# Altium schematic sheet End OptoSwitch.SchDoc
size A4
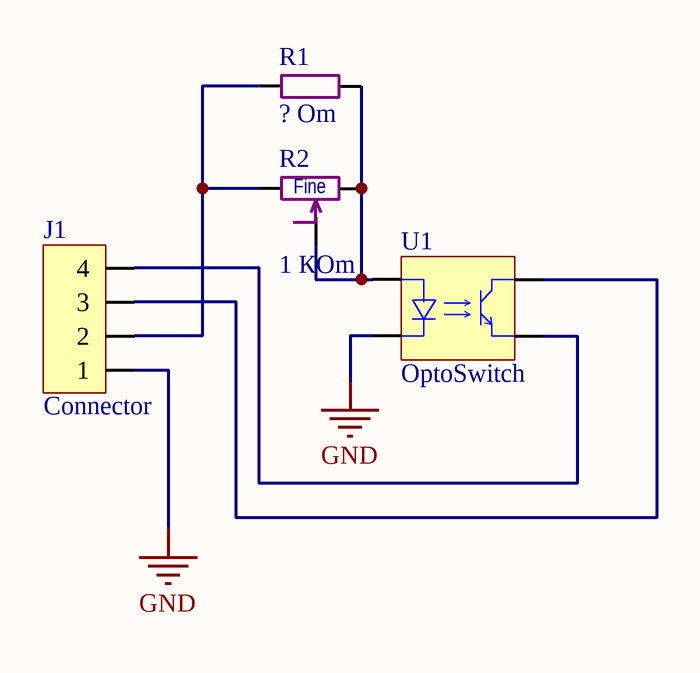
[diagram p0: End OptoSwitch.SchDoc]

## Parts
J1  Connector  [Molex Micro-Fit 3.0 - 4 pin D R]
R1  ? Om  [SMD 0805 (2012)]
R2  1 КOm  [Res Adj 3296 Univ]
U1  OptoSwitch  [OptoSwitch]

## Nets
GND: J1.1 U1.K
NetJ1_2: J1.2 R1.1 R2.1
NetJ1_3: J1.3 U1.C
NetJ1_4: J1.4 U1.E
NetR1_2: R1.2 R2.2 R2.3 U1.A

## Notes on the sheet
- (in symbol Res Adj 3296) Fine

## Library data of the parts
J1 = Micro-Fit 4R (2x2): Horisontal, Dbl line, Male - 3mm; Part Number: 0430450402; Name: Micro-Fit 3.0; URL: http://www.molex.com/molex/products/datasheet.jsp?part=active/0430450402_PCB_HEADERS.xml
R1 = Res SMD 0805
R2 = Res Adj 3296
U1 = Optocouplier (Switch): Name: OptoSwitch